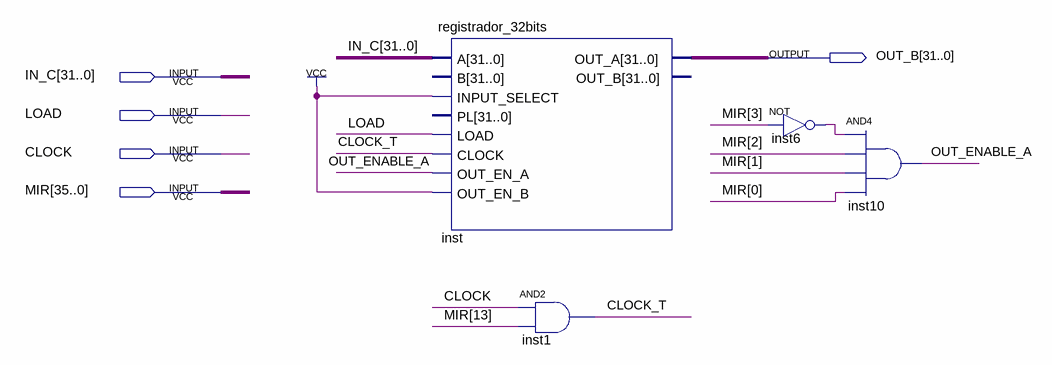
[diagram p0: schematic sheet]
// Quartus schematic TOS.bdf as structural Verilog: 4 symbols, 5 pins
module TOS (
  input  [31:0] IN_C,
  input  LOAD,
  input  CLOCK,
  input  [35:0] MIR,
  output [31:0] OUT_B
);

  wire CLOCK_T, inst6_out, OUT_ENABLE_A;

  registrador_32bits inst (
    .A(IN_C), .INPUT_SELECT(1'b1), .LOAD(LOAD), .CLOCK(CLOCK_T), .OUT_EN_A(OUT_ENABLE_A), .OUT_EN_B(1'b1),
    .OUT_A(OUT_B));  // open: B, PL, OUT_B
  and inst1 (CLOCK_T, CLOCK, MIR[13]);
  not inst6 (inst6_out, MIR[3]);
  and inst10 (OUT_ENABLE_A, inst6_out, MIR[2], MIR[1], MIR[0]);
endmodule
